# EAGLE design ESP32 (EAGLE 9.6.2)
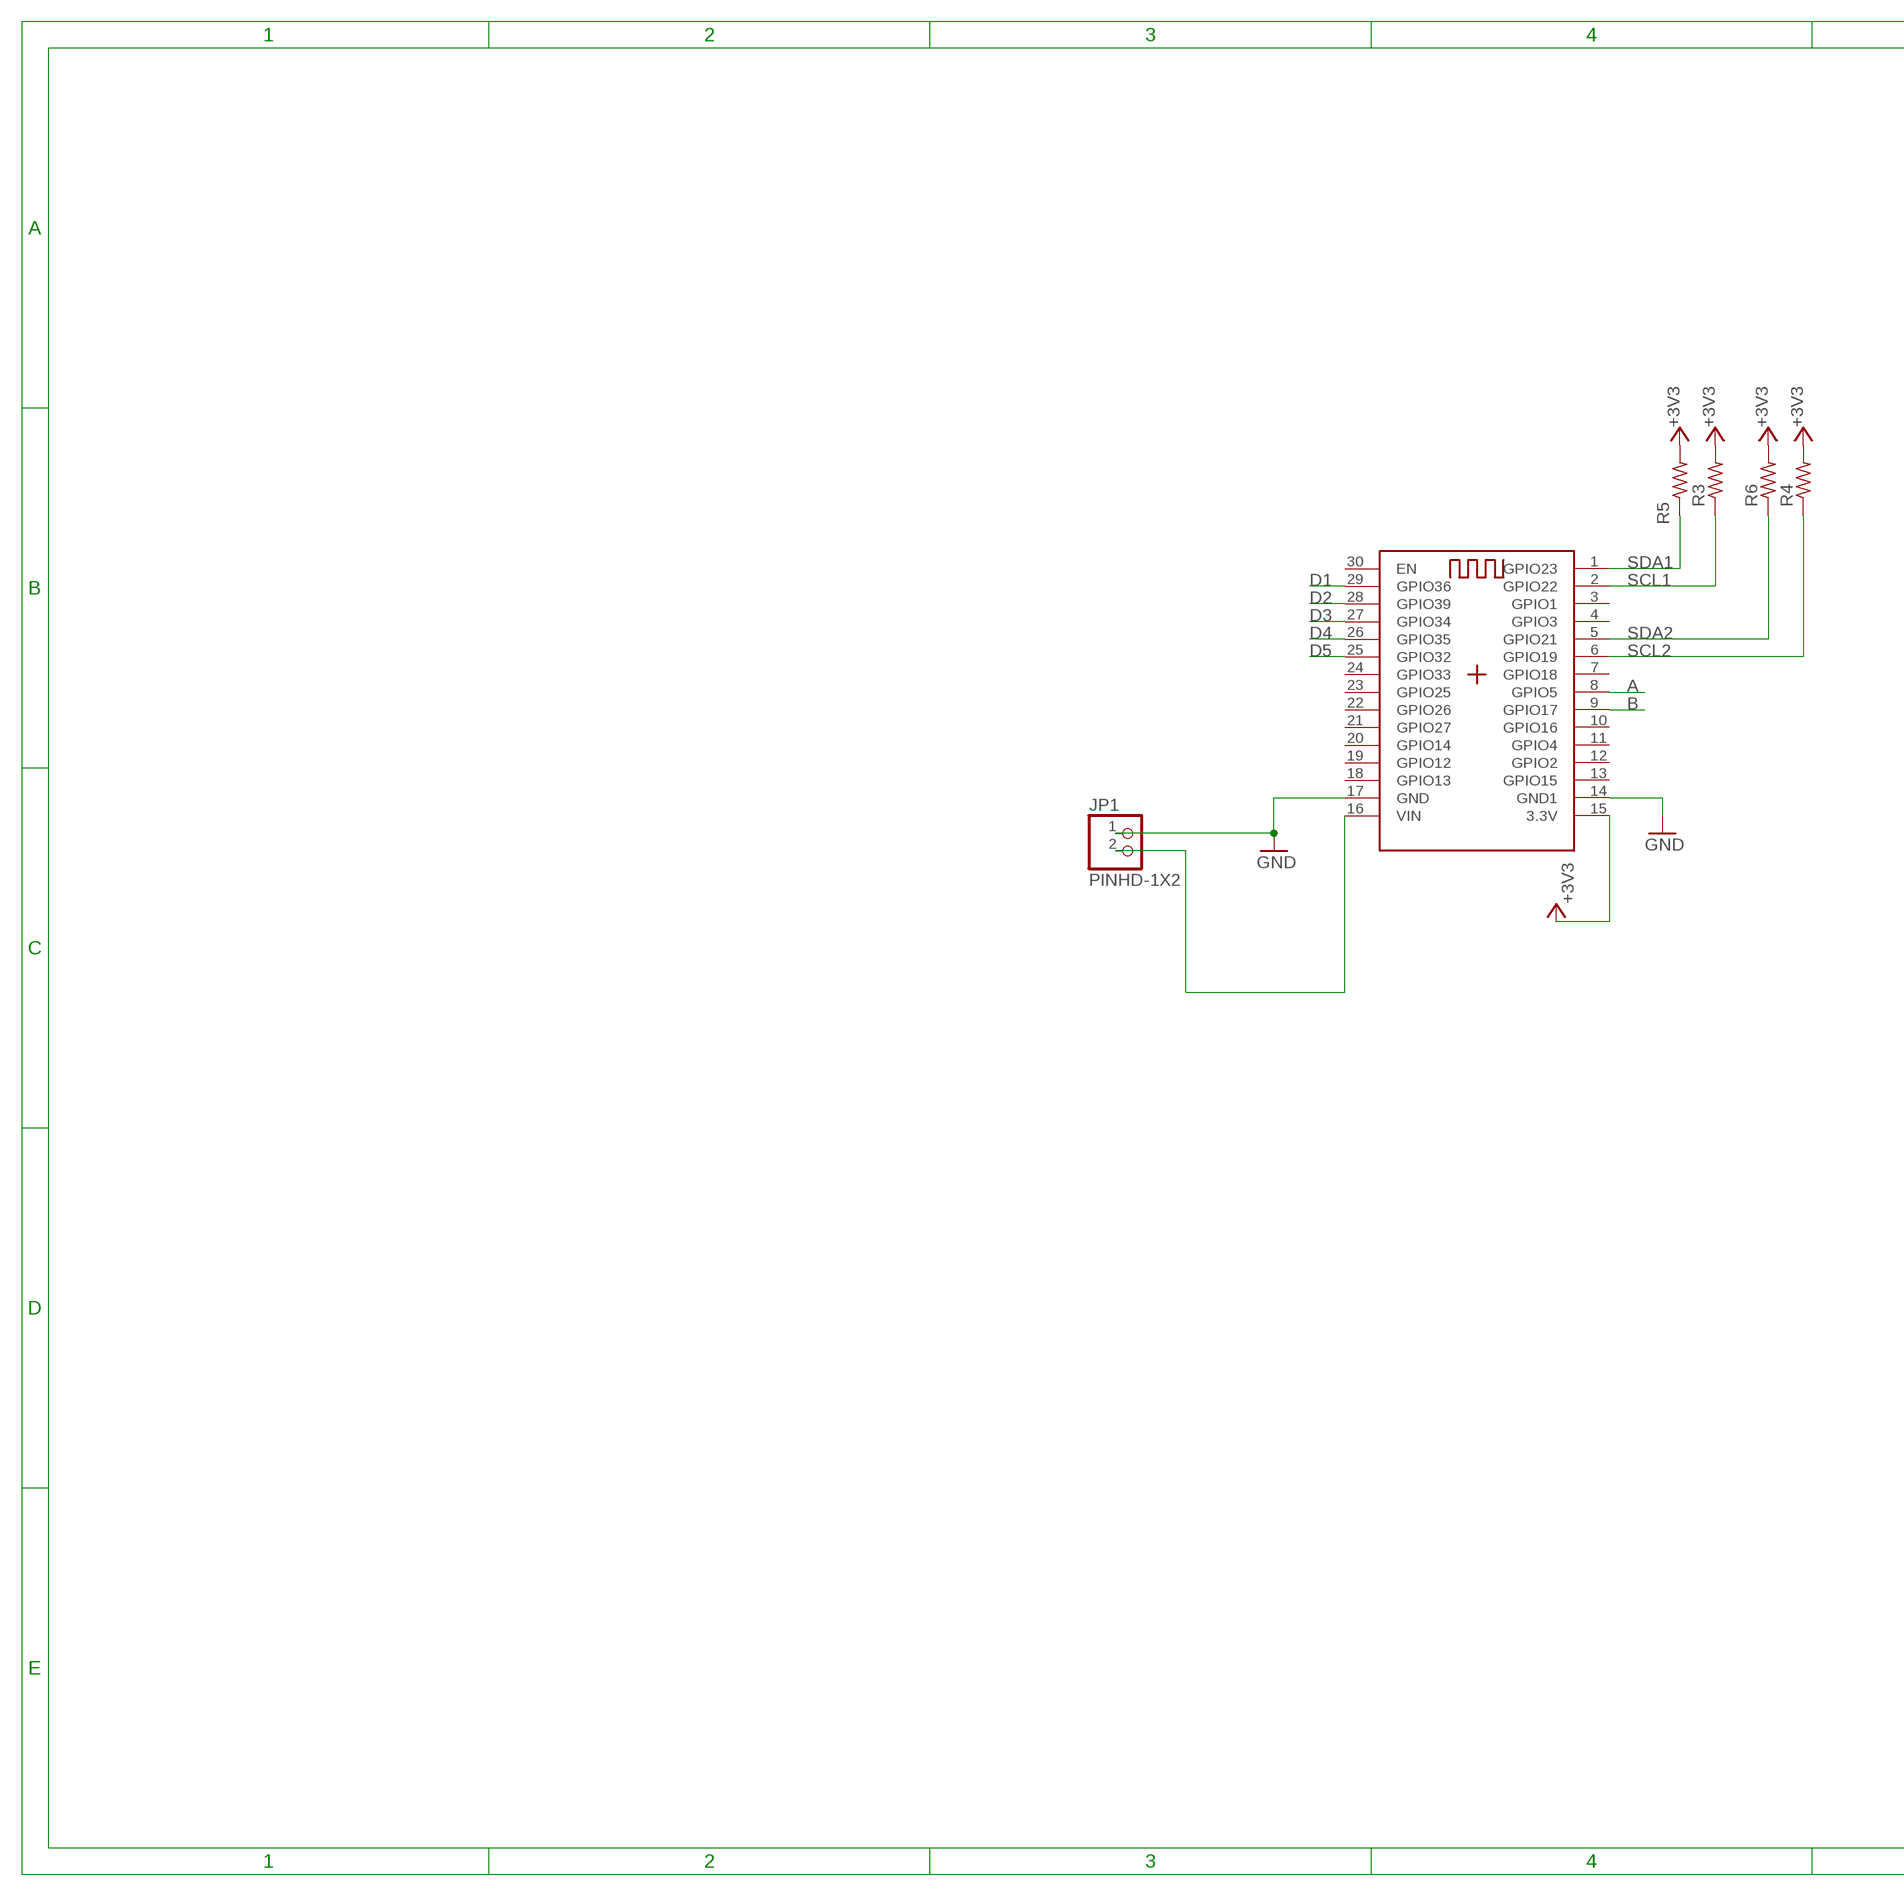
[diagram p0: schematic, sheet 1, part 1 of 2]
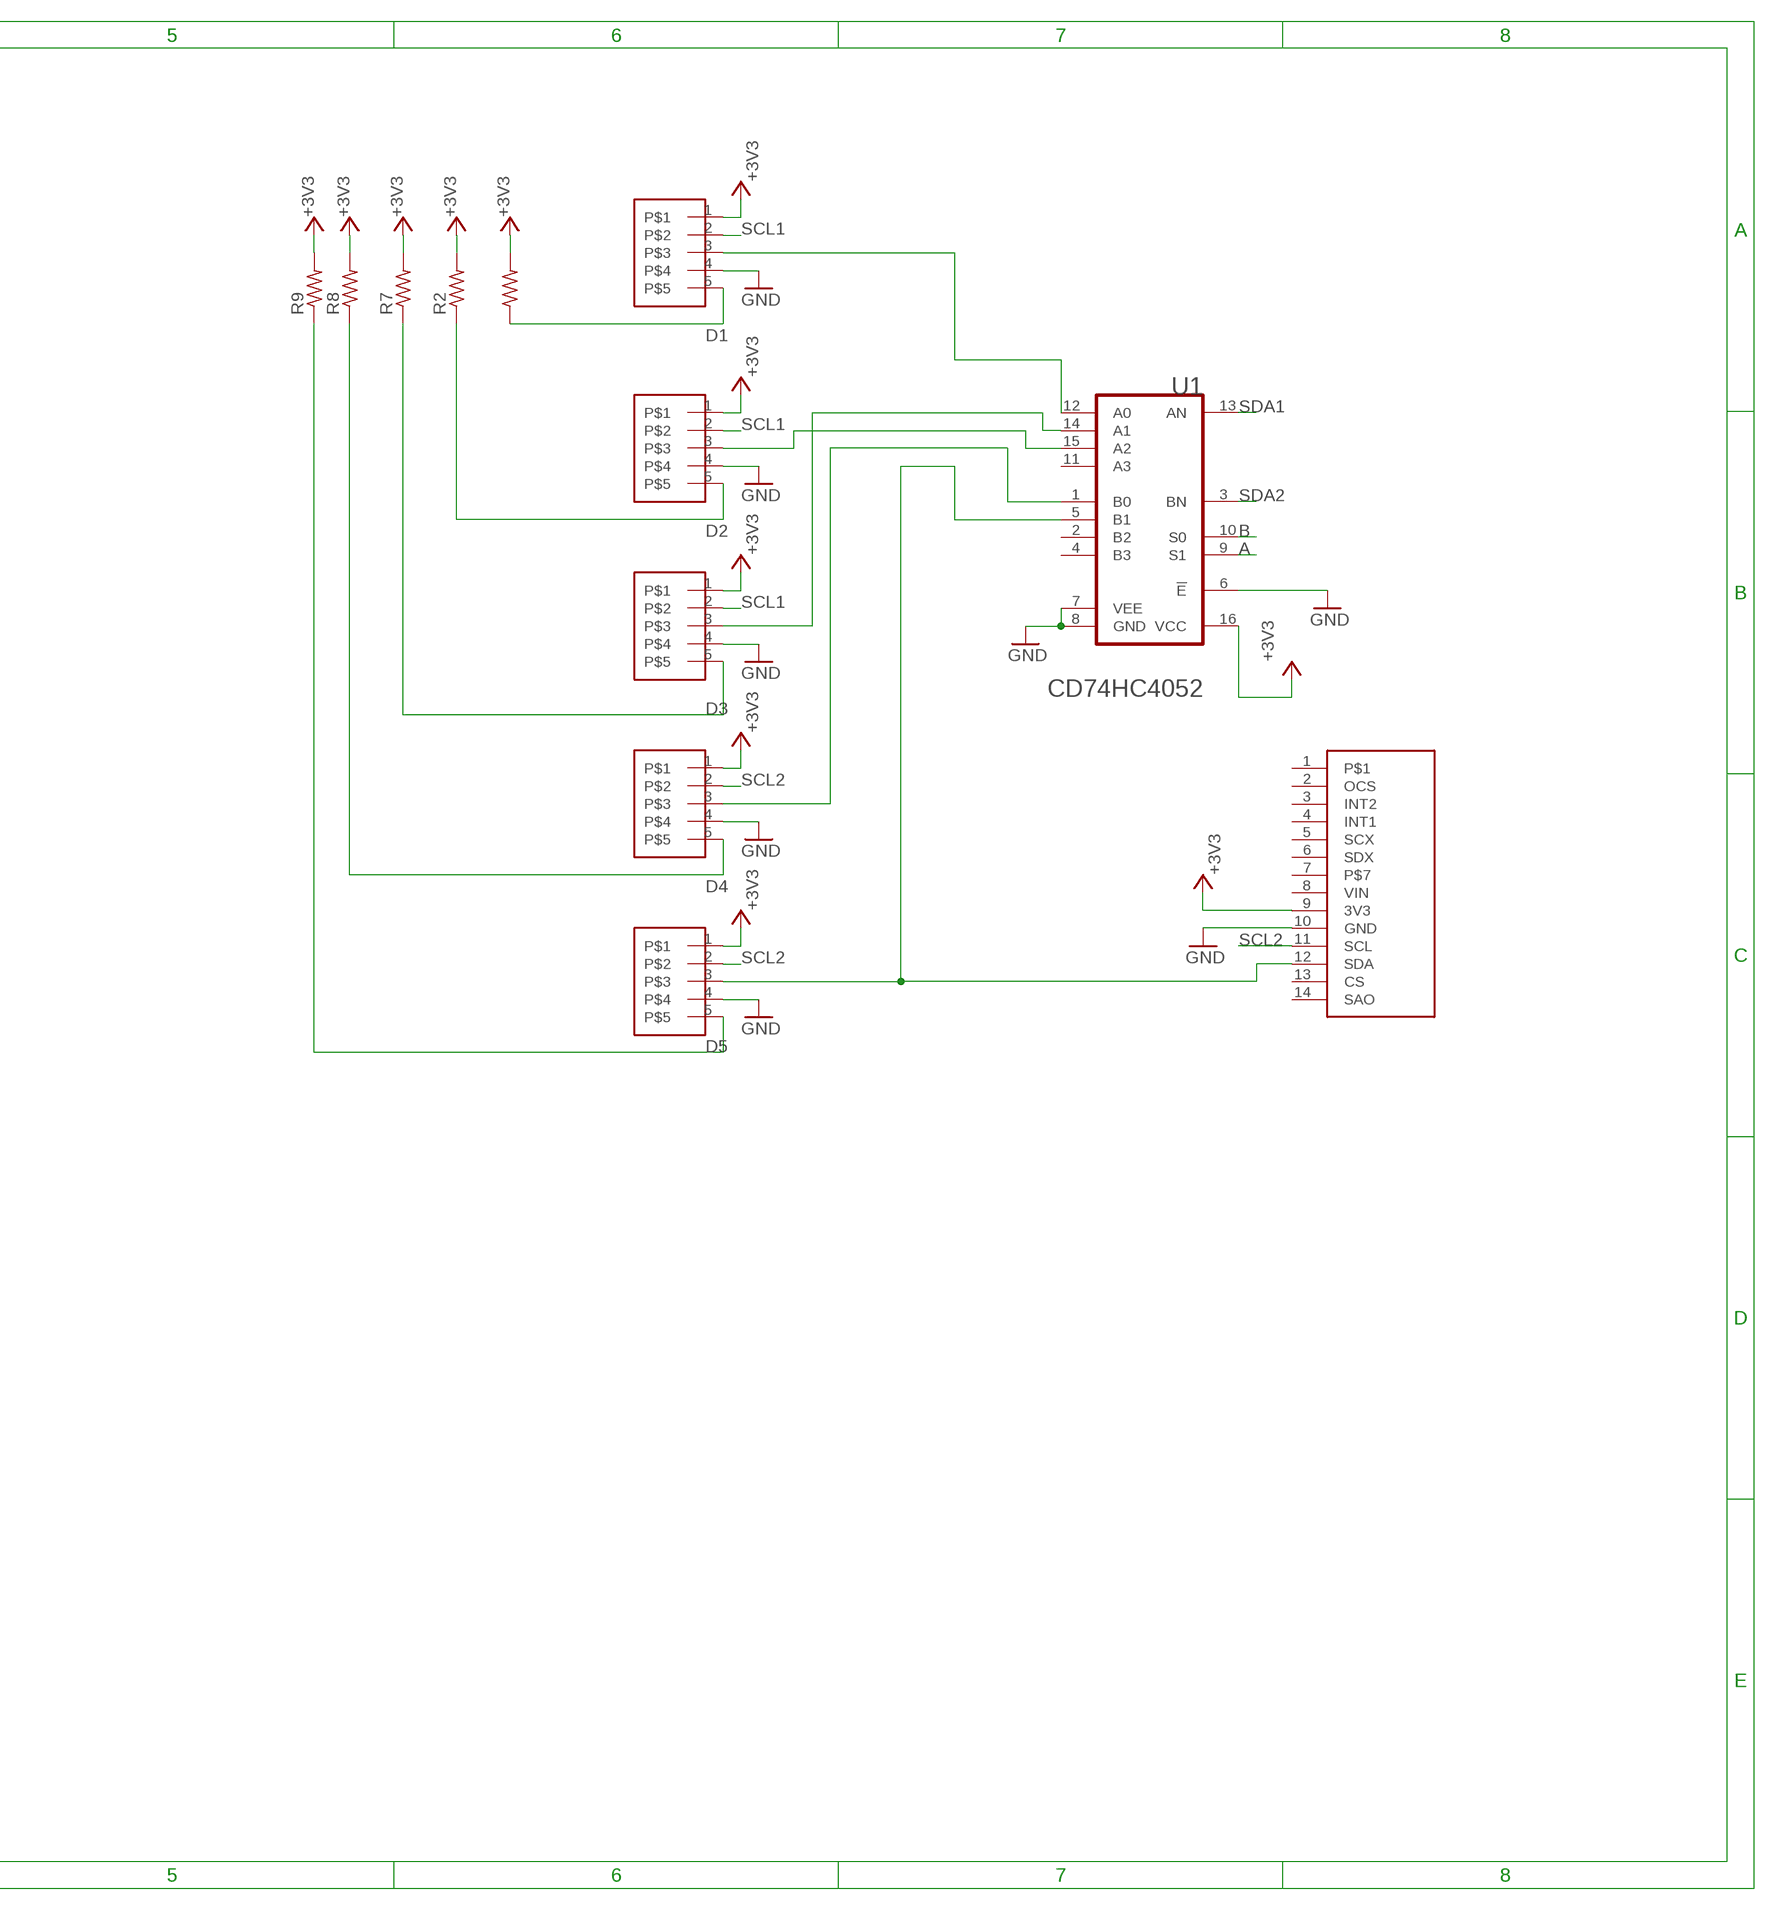
[diagram p1: schematic, sheet 1, part 2 of 2]

## Parts
JP1  PINHD-1X2  [1X02]
R1  10 khom  CRCW08050000Z0EA  [RES_0805]
R2  10 khom  CRCW08050000Z0EA  [RES_0805]
R3  10 kohm  CRCW08050000Z0EA  [RES_0805]
R4  10 kohm  CRCW08050000Z0EA  [RES_0805]
R5  10 khom  CRCW08050000Z0EA  [RES_0805]
R6  10 khom  CRCW08050000Z0EA  [RES_0805]
R7  10 khom  CRCW08050000Z0EA  [RES_0805]
R8  10 khom  CRCW08050000Z0EA  [RES_0805]
R9  10 khom  CRCW08050000Z0EA  [RES_0805]
U1  TEXAS_INSTRUMENTS_CD74HC4052TEXAS_INSTRUMENTS_CD74HC4052_0_0  [TEXAS_INSTRUMENTS_CD74HC4052_0]
U$1  ESP32ESP32  [HDRVR30W70P2540X254_2X15_4572X2794X254B]
U$3  BMI160-MODULEBMI160-MODULE  [HDRV14W64P1016X254_2X7_1800X1300X838B]
U$8  PHMN4-5PHMN4-51  [HDRRA5W70P200_1X5_1200X254X556B]
U$9  PHMN4-5PHMN4-51  [HDRRA5W70P200_1X5_1200X254X556B]
U$10  PHMN4-5PHMN4-51  [HDRRA5W70P200_1X5_1200X254X556B]
U$11  PHMN4-5PHMN4-51  [HDRRA5W70P200_1X5_1200X254X556B]
U$12  PHMN4-5PHMN4-51  [HDRRA5W70P200_1X5_1200X254X556B]

## Nets
+3V3: R1.2 R2.2 R3.2 R4.2 R5.2 R6.2 R7.2 R8.2 R9.2 U1.16(VCC) U$1.15(3.3V) U$3.9(3V3) U$8.1 U$9.1 U$10.1 U$11.1 U$12.1
A: U1.9(S1) U$1.8(GPIO5)
B: U1.10(S0) U$1.9(GPIO17)
D1: R1.1 U$1.29(GPIO36) U$8.5
D2: R2.1 U$1.28(GPIO39) U$9.5
D3: R7.1 U$1.27(GPIO34) U$10.5
D4: R8.1 U$1.26(GPIO35) U$11.5
D5: R9.1 U$1.25(GPIO32) U$12.5
GND: JP1.1 U1.6(!E!) U1.7(VEE) U1.8(GND) U$1.14(GND1) U$1.17(GND) U$3.10(GND) U$8.4 U$9.4 U$10.4 U$11.4 U$12.4
N$1: JP1.2 U$1.16(VIN)
N$9: U1.12(A0) U$8.3
N$10: U1.5(B1) U$3.12(SDA) U$12.3
N$12: U1.15(A2) U$9.3
N$14: U1.14(A1) U$10.3
N$16: U1.1(B0) U$11.3
SCL1: R3.1 U$1.2(GPIO22) U$8.2 U$9.2 U$10.2
SCL2: R4.1 U$1.6(GPIO19) U$3.11(SCL) U$11.2 U$12.2
SDA1: R5.1 U1.13(AN) U$1.1(GPIO23)
SDA2: R6.1 U1.3(BN) U$1.5(GPIO21)
Unconnected: U1.2(B2) U1.4(B3) U1.11(A3) U$1.3(GPIO1) U$1.4(GPIO3) U$1.7(GPIO18) U$1.10(GPIO16) U$1.11(GPIO4) U$1.12(GPIO2) U$1.13(GPIO15) U$1.18(GPIO13) U$1.19(GPIO12) U$1.20(GPIO14) U$1.21(GPIO27) U$1.22(GPIO26) U$1.23(GPIO25) U$1.24(GPIO33) U$1.30(EN) U$3.1 U$3.2(OCS) U$3.3(INT2) U$3.4(INT1) U$3.5(SCX) U$3.6(SDX) U$3.7 U$3.8(VIN) U$3.13(CS) U$3.14(SAO)

## Library data of the parts
JP1 = Connector:PINHD-1X2: PIN HEADER; CATEGORY: CONNECTOR; SUB-CATEGORY: PIN-HEADER
R1-R9 = Resistor_Capacitor:CRCW08050000Z0EA: RES SMD 0 OHM JUMPER 1/8W 0805 Manufacturer's datasheet <http://www.vishay.com/docs/20035/dcrcwe3.pdf>; CREATED_BY: PCBLayout.com; DIGIKEY_PART_NUMBER: 541-0.0ATR-ND; MANUFACTURER: Vishay Dale; MPN: CRCW08050000Z0EA; PACKAGE: SMD 0805
U1 = CD74HC4052:TEXAS_INSTRUMENTS_CD74HC4052: TI-CD74HCX4052-16; BANDWIDTH_MAX_MHZ: 185; CIIVA_IDS: 1253716; CODE__JEDEC: MS-012 variation AC; CONFIGURATION: 2 X 1:4 MUX; CROSSTALK: Yes; DATASHEET_VERSION: SCHS122J; FOOTPRINT_VARIANT_NAME_0: Level C; FOOTPRINT_VARIANT_NAME_1: Level B; FOOTPRINT_VARIANT_NAME_2: Level A; IMPORTED: yes; IMPORTED_FROM: vault; IMPORT_TS: 1521868347; MF: Texas Instruments; MPN: CD74HC4052; OPERATING_TEMPERATURE_RANGEC: -55 to 125; OUTPUT_TYPE: CMOS; PACKAGE: D0016A; PACKAGE_VERSION: http://www.ti.com/lit/ml/mpds178g/mpds178g.pdf; PREFIX: U; RATING: Catalog; RELEASE_DATE: 1459237772; RON_MAX_OHMS: 130; RON_TYP_OHMS: 45; VAULT_GUID: CFC506C9-AF5A-426E-A11A-E921BFE79270; VAULT_REVISION: E7CDEA28-D318-4063-8C47-5D5FCDCA84B0; VCC_MAX_V: 6; VCC_MIN_V: 2
U$1 = USER:ESP32
U$3 = USER:BMI160-MODULE
U$8-U$12 = USER:PHMN4-5

## Board
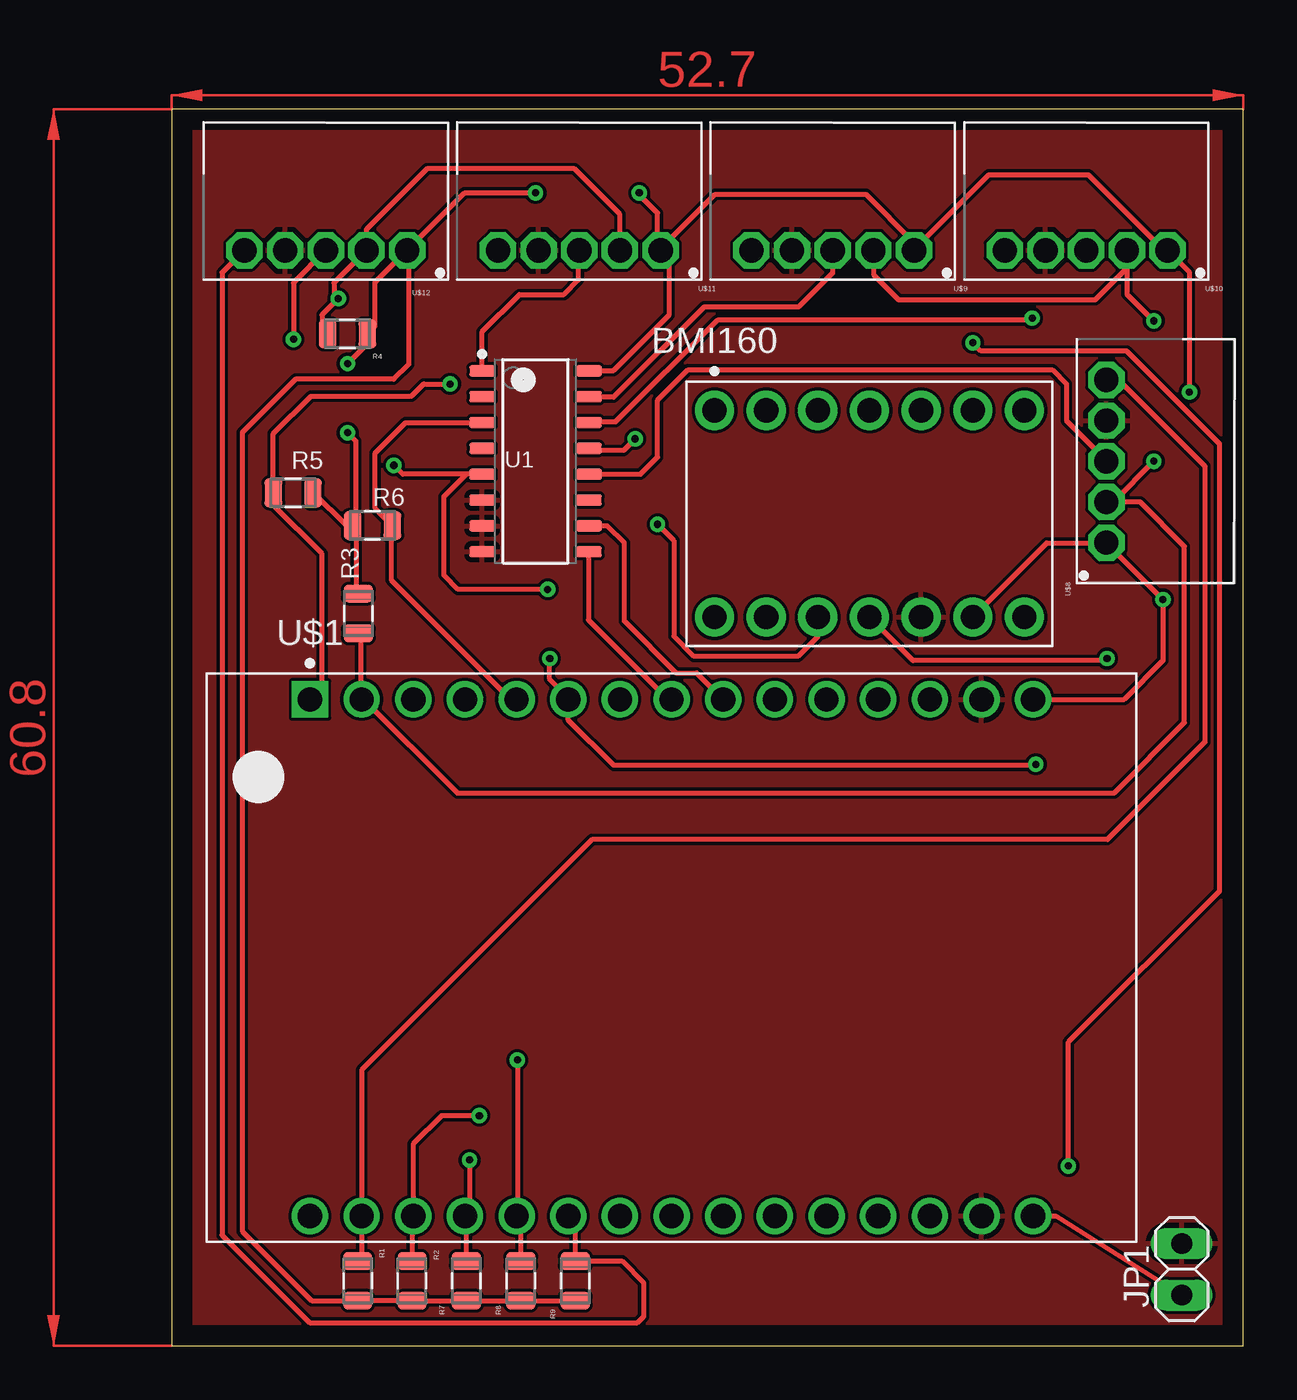
[diagram p2: board, top side]
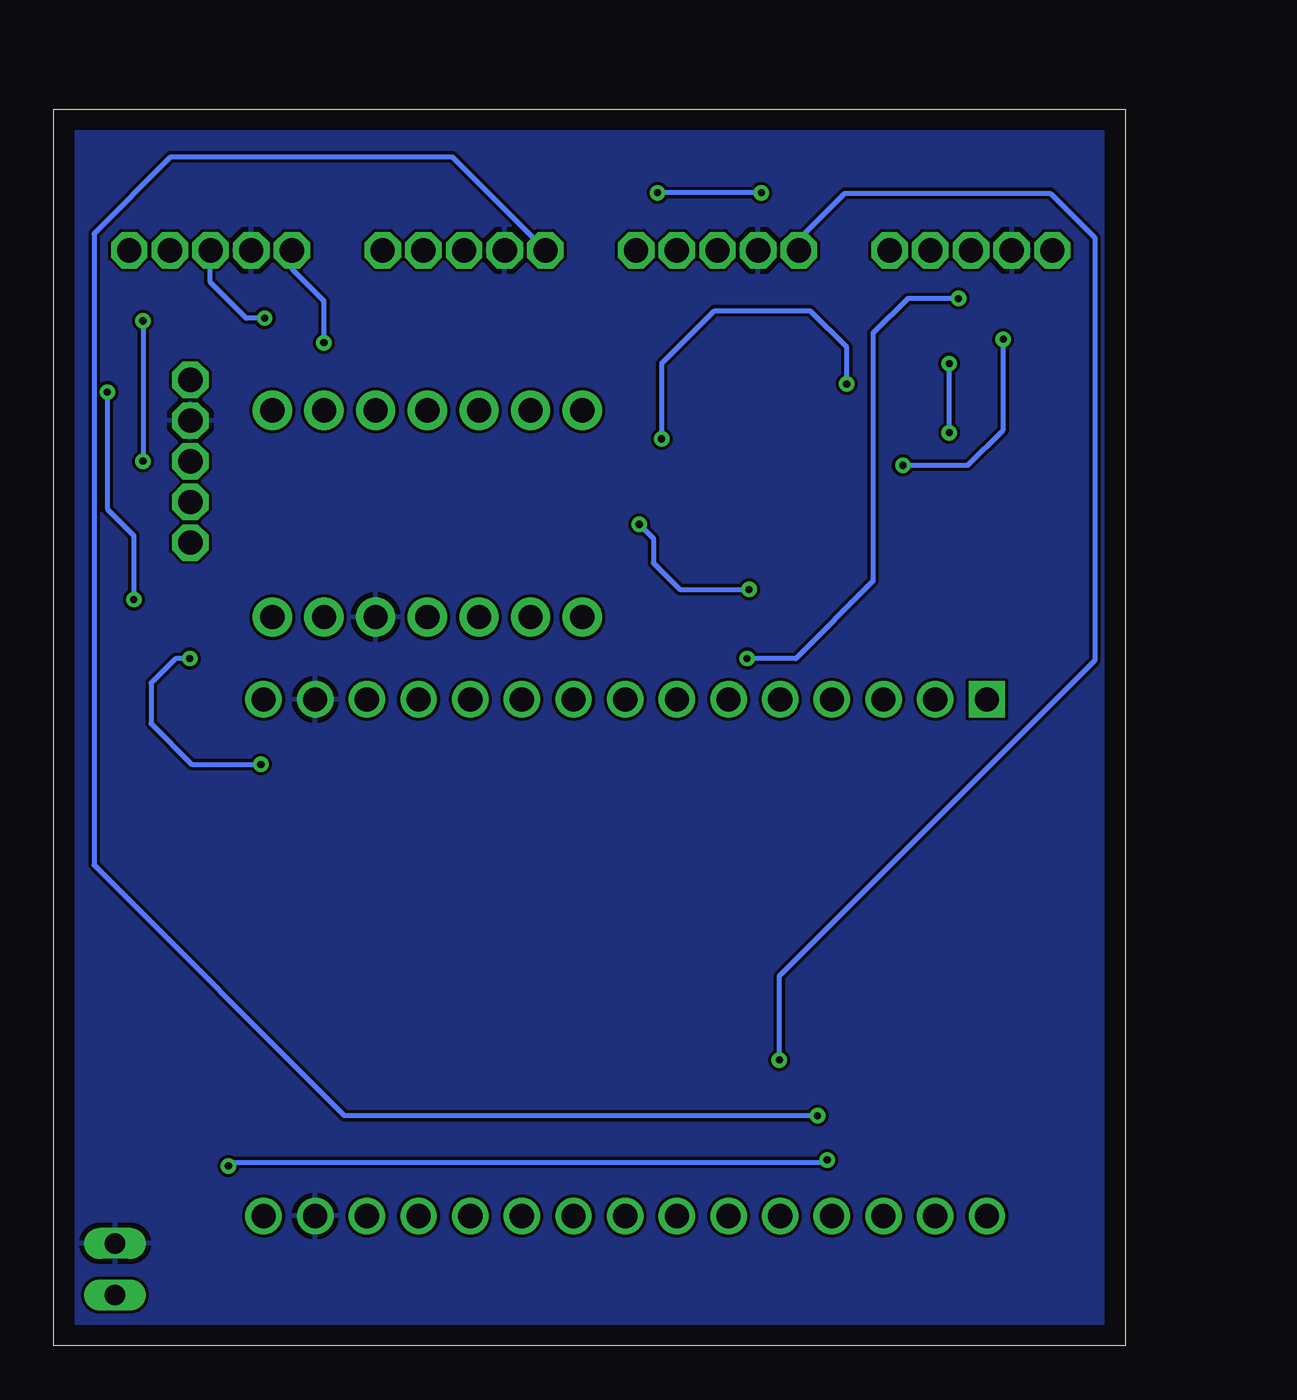
[diagram p3: board, bottom side, seen from below]

Size 52.7 x 60.8 mm. Coordinates in mm from the lower left corner, seen from the top.
Outline: 0,0 52.7,0 52.7,60.8 0,60.8 0,0
Copper layers (1*16): Top 0.035mm / dielectric 1.5mm / Bottom 0.035mm
Design rules "default *": minimum track width 6mil, minimum drill 0.35mm, track to track 6mil, track to pad 0.22mm, pad to pad 6mil, via to via 6mil, smd to smd 6mil, copper to edge 40mil, drill to drill 6mil, minimum pad ring 10mil, minimum via ring 8mil, stop-mask expansion 4mil, vias tented up to drill 0mil, thermal gap 10mil

### Footprints (pad centres in the part's own frame; a part is rotated, then mirrored left to right if it is on the bottom)
1X02 = drill 1.016 long: 1 -1.27,0; 2 1.27,0
RES_0805 = smd 0.87 x 1.42: 1 -0.975,0; 2 0.975,0
TEXAS_INSTRUMENTS_CD74HC4052_0 = smd 1.25 x 0.55: 1 -2.625,4.445; 2 -2.625,3.175; 3 -2.625,1.905; 4 -2.625,0.635; 5 -2.625,-0.635; 6 -2.625,-1.905; 7 -2.625,-3.175; 8 -2.625,-4.445; 9 2.625,-4.445; 10 2.625,-3.175; 11 2.625,-1.905; 12 2.625,-0.635; 13 2.625,0.635; 14 2.625,1.905; 15 2.625,3.175; 16 2.625,4.445
HDRVR30W70P2540X254_2X15_4572X2794X254B = drill 1.19 pad 1.79 square: 1 0,0 | drill 1.19 pad 1.79: 2 2.54,0; 3 5.08,0; 4 7.62,0; 5 10.16,0; 6 12.7,0; 7 15.24,0; 8 17.78,0; 9 20.32,0; 10 22.86,0; 11 25.4,0; 12 27.94,0; 13 30.48,0; 14 33.02,0; 15 35.56,0; 16 35.56,-25.4; 17 33.02,-25.4; 18 30.48,-25.4; 19 27.94,-25.4; 20 25.4,-25.4; 21 22.86,-25.4; 22 20.32,-25.4; 23 17.78,-25.4; 24 15.24,-25.4; 25 12.7,-25.4; 26 10.16,-25.4; 27 7.62,-25.4; 28 5.08,-25.4; 29 2.54,-25.4; 30 0,-25.4
HDRV14W64P1016X254_2X7_1800X1300X838B = drill 1.19 pad 1.93: 1 0,0; 2 2.54,0; 3 5.08,0; 4 7.62,0; 5 10.16,0; 6 12.7,0; 7 15.24,0; 8 15.24,-10.16; 9 12.7,-10.16; 10 10.16,-10.16; 11 7.62,-10.16; 12 5.08,-10.16; 13 2.54,-10.16; 14 0,-10.16
HDRRA5W70P200_1X5_1200X254X556B = drill 1.19 pad 1.79 octagon: 1 2,6.25; 2 4,6.25; 3 6,6.25; 4 8,6.25; 5 10,6.25

### Placement (x,y rotation side)
JP1  49.67,3.77 270 top
R1  9.15,3.21 270 top
R2  11.83,3.21 270 top
R3  9.19,36.01 90 top
R4  8.66,49.76 0 top
R5  5.99,41.94 0 top
R6  9.89,40.34 180 top
R7  14.5,3.21 270 top
R8  17.18,3.21 270 top
R9  19.85,3.21 270 top
U1  17.9,43.5 0 top
U$1  6.81,31.79 0 top
U$3  26.7,46 0 top
U$8  52.22,37.5 90 top
U$9  38.51,60.12 180 top
U$10  50.98,60.12 180 top
U$11  26.05,60.12 180 top
U$12  13.59,60.12 180 top

### Tracks (layer width: path | path; a pad name or v marks a point on that pad's centre or on a via)
+3V3  (via drill 0.35)
  Top 0.254: U$11.1 24.45,53.47 24.45,50.67 21.73,47.95 U1.16 | U$11.1 24.33,54.23 26.73,56.63 34.14,56.63 36.51,54.25 U$9.1 36.63,54.03 40.18,57.58 45.09,57.58 48.65,54.02 48.84,54.02 U$10.1 50.05,52.8 v50.05,46.9 | R6.2 8.6,40.34 7,41.94 R5.2 | U$11.1 23.9,54.02 23.9,55.7 23,56.6 v23,56.7 | U$12.1 14.42,56.7 v17.9,56.7 | R3.2 9.09,37.09 9.09,40.15 R6.2 | U$12.1 11.66,53.8 11.66,48.26 10.93,47.53 6.1,47.53 3.48,44.91 3.48,5.65 6.89,2.23 R1.2 R2.2 R7.2 R8.2 R9.2 | U$12.1 9.99,52.27 9.99,50.12 R4.2 9.63,49.27 v8.66,48.3 | v8.66,44.9 9.06,44.5 9.06,40.49 R6.2 | 45.97,39.48 v48.75,36.7 48.75,33.7 46.84,31.79 U$1.15 | 45.97,39.48 U$8.1 | U$3.9 43.04,39.48 45.97,39.48
  Bottom 0.254: v17.9,56.7 v23,56.7 | v8.66,44.9 v8.66,48.3 | v50.05,46.9 50.05,41.15 48.75,39.85 v48.75,36.7
A
  Top 0.254: U1.9 20.5,39.03 20.5,35.7 24.41,31.79 U$1.8
B
  Top 0.254: U1.10 21.43,40.33 22.27,39.48 22.27,35.63 24.8,33.1 25.82,33.1 U$1.9
D1
  Top 0.254: U$8.5 46.57,47.5 50.81,43.25 50.81,29.69 46.02,24.9 20.68,24.9 9.35,13.57 U$1.29 9.35,5.98 9.35,4.29 9.24,4.18 R1.1
D2  (via drill 0.35)
  Top 0.254: 15.2,11.32 v15.13,11.32 13.28,11.32 11.89,9.94 U$1.28 11.83,6.33 R2.1
  Bottom 0.254: v15.13,11.32 38.38,11.32 50.71,23.65 50.71,54.69 46.93,58.47 33.11,58.47 U$9.5
D3  (via drill 0.35)
  Top 0.254: v44.1,8.85 44.1,14.94 51.52,22.36 51.52,44.38 46.97,48.92 39.8,48.92 v39.41,49.33 | R7.1 14.5,6.32 U$1.27 14.66,6.62 v14.66,9.15
  Bottom 0.254: v39.41,49.33 39.41,51.38 40.98,52.95 U$10.5 | v14.66,9.15 14.77,9.04 43.91,9.04 v44.1,8.85
D4  (via drill 0.35)
  Top 0.254: 16.99,14.06 v17.01,14.06 17.01,6.43 U$1.26 17.18,6.18 R8.1
  Bottom 0.254: U$11.5 16.05,54.41 13.79,56.67 3.69,56.67 1.5,54.48 1.5,33.7 17.01,18.19 v17.01,14.06
D5
  Top 0.254: U$12.5 2.49,52.77 2.49,5.45 6.8,1.14 22.91,1.14 23.21,1.44 23.21,3.11 22.14,4.18 R9.1 19.85,4.51 19.85,6.05 U$1.25
GND
  pour Top: 0,-0.1 0,60.8 52.98,60.8 52.98,0
  pour Bottom: 0,0 0,60.8 52.95,60.8 52.95,0
N$1
  Top 0.254: U$1.16 43.48,6.39 JP1.2
N$9
  Top 0.254: U$8.3 45.97,43.54 44,45.51 44,47.3 43.3,48 38.2,48 25.4,48 23.9,46.5 23.9,43.7 23.07,42.87 U1.12
N$10  (via drill 0.35)
  Top 0.254: U$12.3 6,52.28 v6,49.5 | v10.94,43.3 11.37,42.87 14.5,42.87 | U1.5 14.5,42.87 | v23.9,40.4 24.7,39.6 24.7,34.9 25.7,33.9 30.8,33.9 31.78,34.88 U$3.12 | v18.5,37.2 14.1,37.2 13.4,37.9 13.4,41.77 14.5,42.87
  Bottom 0.254: v10.94,43.3 7.74,43.3 6,45.03 v6,49.5 | v23.9,40.4 23.2,39.7 23.2,38.5 21.9,37.2 v18.5,37.2
N$12
  Top 0.254: U$9.3 32.51,52.77 30.84,51.1 26.2,51.1 21.74,46.64 20.56,46.64 U1.15
N$14  (via drill 0.35)
  Top 0.254: U1.14 20.56,45.44 21.84,45.44 26.84,50.44 42.22,50.44 v42.32,50.53
  Bottom 0.254: v42.32,50.53 43.22,50.53 45.02,52.34 45.02,53.83 U$10.3
N$16
  Top 0.254: U$11.3 20.03,53.87 20.03,52.43 19.3,51.7 17.11,51.7 15.28,49.87 U1.1
SCL1  (via drill 0.35)
  Top 0.254: U$9.2 34.51,52.68 35.75,51.44 45.42,51.44 46.98,53 | R3.1 9.3,34.93 9.3,31.79 U$1.2 9.46,31.79 14.06,27.19 46.35,27.19 49.81,30.65 49.81,39.31 47.62,41.5 46.3,41.5 | U$10.2 46.98,53 | 46.98,53 46.98,51.72 v48.3,50.4 | v48.3,43.5 46.3,41.5 | 46.3,41.5 U$8.2
  Bottom 0.254: v48.3,50.4 v48.3,43.5
SCL2  (via drill 0.35)
  Top 0.254: U$11.2 22.05,55.64 19.81,57.88 12.56,57.88 9.59,54.91 U$12.2 7.99,52.27 7.99,51.29 v8.2,51.5 7.4,50.7 7.4,50.04 R4.1 | v18.6,33.8 18.6,32.78 19.51,31.87 U$1.6 19.51,30.79 21.75,28.55 42.45,28.55 v42.5,28.6 | U$3.11 36.46,33.7 45.9,33.7 v46,33.8
  Bottom 0.254: v8.2,51.5 10.7,51.5 12.4,49.8 12.4,37.6 16.2,33.8 v18.6,33.8 | v46,33.8 46.7,33.8 47.9,32.6 47.9,30.6 45.9,28.6 v42.5,28.6
SDA1  (via drill 0.35)
  Top 0.254: v22.8,44.6 22.23,44.03 20.62,44.03 U1.13 | v13.7,47.3 12.4,47.3 11.8,46.7 6.86,46.7 5.01,44.85 R5.1 5.01,41.34 7.4,38.95 7.4,31.94 6.96,31.94 U$1.1
  Bottom 0.254: v13.7,47.3 13.7,49.1 15.5,50.9 20.2,50.9 22.8,48.3 v22.8,44.6
SDA2
  Top 0.254: U1.3 15.26,45.39 11.51,45.39 10.03,43.91 10.03,41.17 R6.1 10.81,40.29 10.81,37.66 16.68,31.79 U$1.5
(copper drawn outside any net)
  shapes: Top area x2